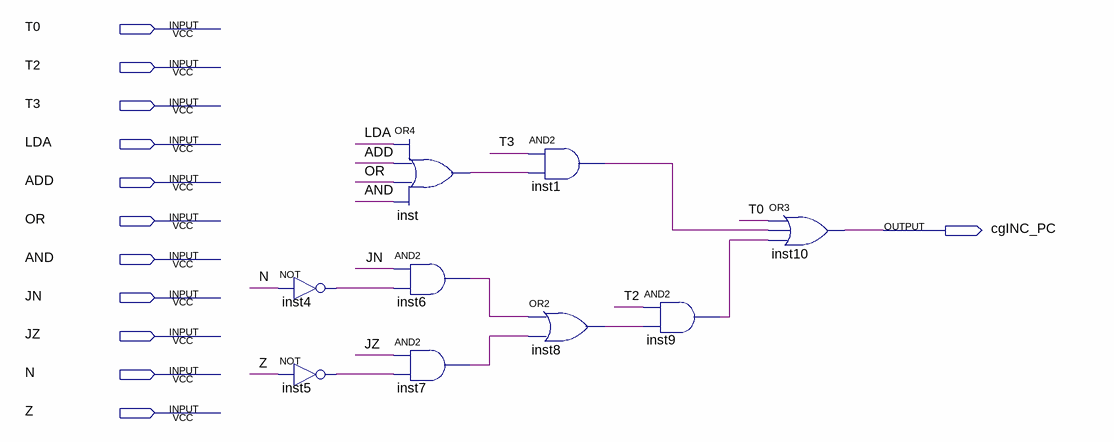
[diagram p0: schematic sheet]
// Quartus schematic abk_carga_incrementa_pc.bdf as structural Verilog: 9 symbols, 12 pins
module abk_carga_incrementa_pc (
  input  T0,
  input  T2,
  input  T3,
  input  LDA,
  input  ADD,
  input  OR,
  input  AND,
  input  JN,
  input  JZ,
  input  N,
  input  Z,
  output cgINC_PC
);

  wire inst1_out, inst4_out, inst5_out, inst6_out, inst7_out, inst8_out, inst9_out, inst_out;

  not inst4 (inst4_out, N);
  not inst5 (inst5_out, Z);
  or inst (inst_out, LDA, ADD, OR, AND);
  and inst6 (inst6_out, JN, inst4_out);
  and inst7 (inst7_out, JZ, inst5_out);
  and inst1 (inst1_out, T3, inst_out);
  or inst8 (inst8_out, inst6_out, inst7_out);
  and inst9 (inst9_out, T2, inst8_out);
  or inst10 (cgINC_PC, T0, inst1_out, inst9_out);
endmodule
